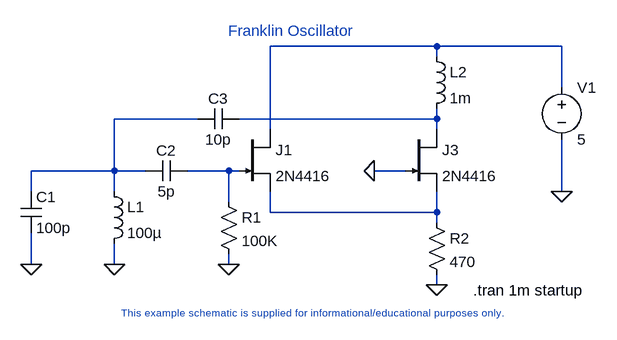
[diagram p0: schematic Franklin.asc]
Franklin.asc, the LTspice schematic file:
Version 4
SHEET 1 1968 1760
WIRE 1584 1264 1328 1264
WIRE 1776 1264 1584 1264
WIRE 1584 1280 1584 1264
WIRE 1776 1328 1776 1264
WIRE 1216 1376 1088 1376
WIRE 1584 1376 1584 1360
WIRE 1584 1376 1280 1376
WIRE 1328 1392 1328 1264
WIRE 1584 1392 1584 1376
WIRE 1088 1456 1088 1376
WIRE 1088 1456 960 1456
WIRE 1136 1456 1088 1456
WIRE 1264 1456 1200 1456
WIRE 1280 1456 1264 1456
WIRE 1536 1456 1488 1456
WIRE 960 1488 960 1456
WIRE 1088 1488 1088 1456
WIRE 1776 1488 1776 1408
WIRE 1264 1504 1264 1456
WIRE 1328 1520 1328 1488
WIRE 1584 1520 1584 1488
WIRE 1584 1520 1328 1520
WIRE 1584 1536 1584 1520
WIRE 960 1600 960 1552
WIRE 1088 1600 1088 1568
WIRE 1264 1600 1264 1584
WIRE 1584 1632 1584 1616
FLAG 1088 1600 0
FLAG 960 1600 0
FLAG 1264 1600 0
FLAG 1584 1632 0
FLAG 1776 1488 0
FLAG 1488 1456 0
SYMBOL njf 1280 1392 R0
SYMATTR InstName J1
SYMATTR Value 2N4416
SYMBOL ind 1072 1472 R0
SYMATTR InstName L1
SYMATTR Value 100µ
SYMBOL cap 944 1488 R0
SYMATTR InstName C1
SYMATTR Value 100p
SYMBOL cap 1200 1440 R90
WINDOW 0 0 32 VBottom 2
WINDOW 3 32 32 VTop 2
SYMATTR InstName C2
SYMATTR Value 5p
SYMBOL res 1248 1488 R0
SYMATTR InstName R1
SYMATTR Value 100K
SYMBOL voltage 1776 1312 R0
SYMATTR InstName V1
SYMATTR Value 5
SYMBOL njf 1536 1392 R0
SYMATTR InstName J3
SYMATTR Value 2N4416
SYMBOL res 1568 1520 R0
SYMATTR InstName R2
SYMATTR Value 470
SYMBOL ind 1568 1264 R0
SYMATTR InstName L2
SYMATTR Value 1m
SYMBOL cap 1280 1360 R90
WINDOW 0 0 32 VBottom 2
WINDOW 3 32 32 VTop 2
SYMATTR InstName C3
SYMATTR Value 10p
TEXT 1640 1640 Left 2 !.tran 1m startup
TEXT 1360 1256 Bottom 2 ;Franklin Oscillator
TEXT 1384 1664 Top 1 ;This example schematic is supplied for informational/educational purposes only.

The netlist it stands for:
* Franklin.asc
J1 N001 N004 N005 2N4416
L1 N002 0 100µ
C1 N002 0 100p
C2 N004 N002 5p
R1 N004 0 100K
V1 N001 0 5
J3 N003 0 N005 2N4416
R2 N005 0 470
L2 N001 N003 1m
C3 N003 N002 10p
.model NJF NJF
.model PJF PJF
.lib standard.jft
.tran 1m startup
* Franklin Oscillator
* This example schematic is supplied for informational/educational purposes only.
.backanno
.end